# Altium schematic sheet rpi_pico.SchDoc
size A4; SheetNumber: 2; SheetTotal: 2
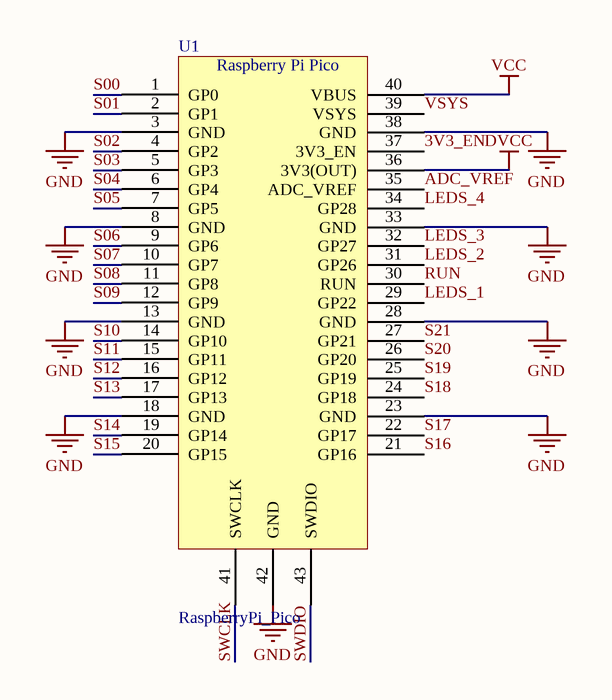
[diagram p0: rpi_pico.SchDoc]

## Parts
U1  RaspberryPi_Pico  [PiPico_Holes]

## Nets
DVCC: U1.36(3V3(OUT))
GND: U1.3(GND) U1.8(GND) U1.13(GND) U1.18(GND) U1.23(GND) U1.28(GND) U1.33(GND) U1.38(GND) U1.42(GND)
VCC: U1.40(VBUS)
3V3_EN: U1.37(3V3_EN)
ADC_VREF: U1.35(ADC_VREF)
LEDS_1: U1.29(GP22)
LEDS_2: U1.31(GP26)
LEDS_3: U1.32(GP27)
LEDS_4: U1.34(GP28)
RUN: U1.30(RUN)
S00: U1.1(GP0)
S01: U1.2(GP1)
S02: U1.4(GP2)
S03: U1.5(GP3)
S04: U1.6(GP4)
S05: U1.7(GP5)
S06: U1.9(GP6)
S07: U1.10(GP7)
S08: U1.11(GP8)
S09: U1.12(GP9)
S10: U1.14(GP10)
S11: U1.15(GP11)
S12: U1.16(GP12)
S13: U1.17(GP13)
S14: U1.19(GP14)
S15: U1.20(GP15)
S16: U1.21(GP16)
S17: U1.22(GP17)
S18: U1.24(GP18)
S19: U1.25(GP19)
S20: U1.26(GP20)
S21: U1.27(GP21)
SWCLK: U1.41(SWCLK)
SWDIO: U1.43(SWDIO)
VSYS: U1.39(VSYS)

## Notes on the sheet
- (in symbol RaspberryPi_Pico) Raspberry Pi Pico